# EAGLE board Armaz connector board (EAGLE 7.3.0)
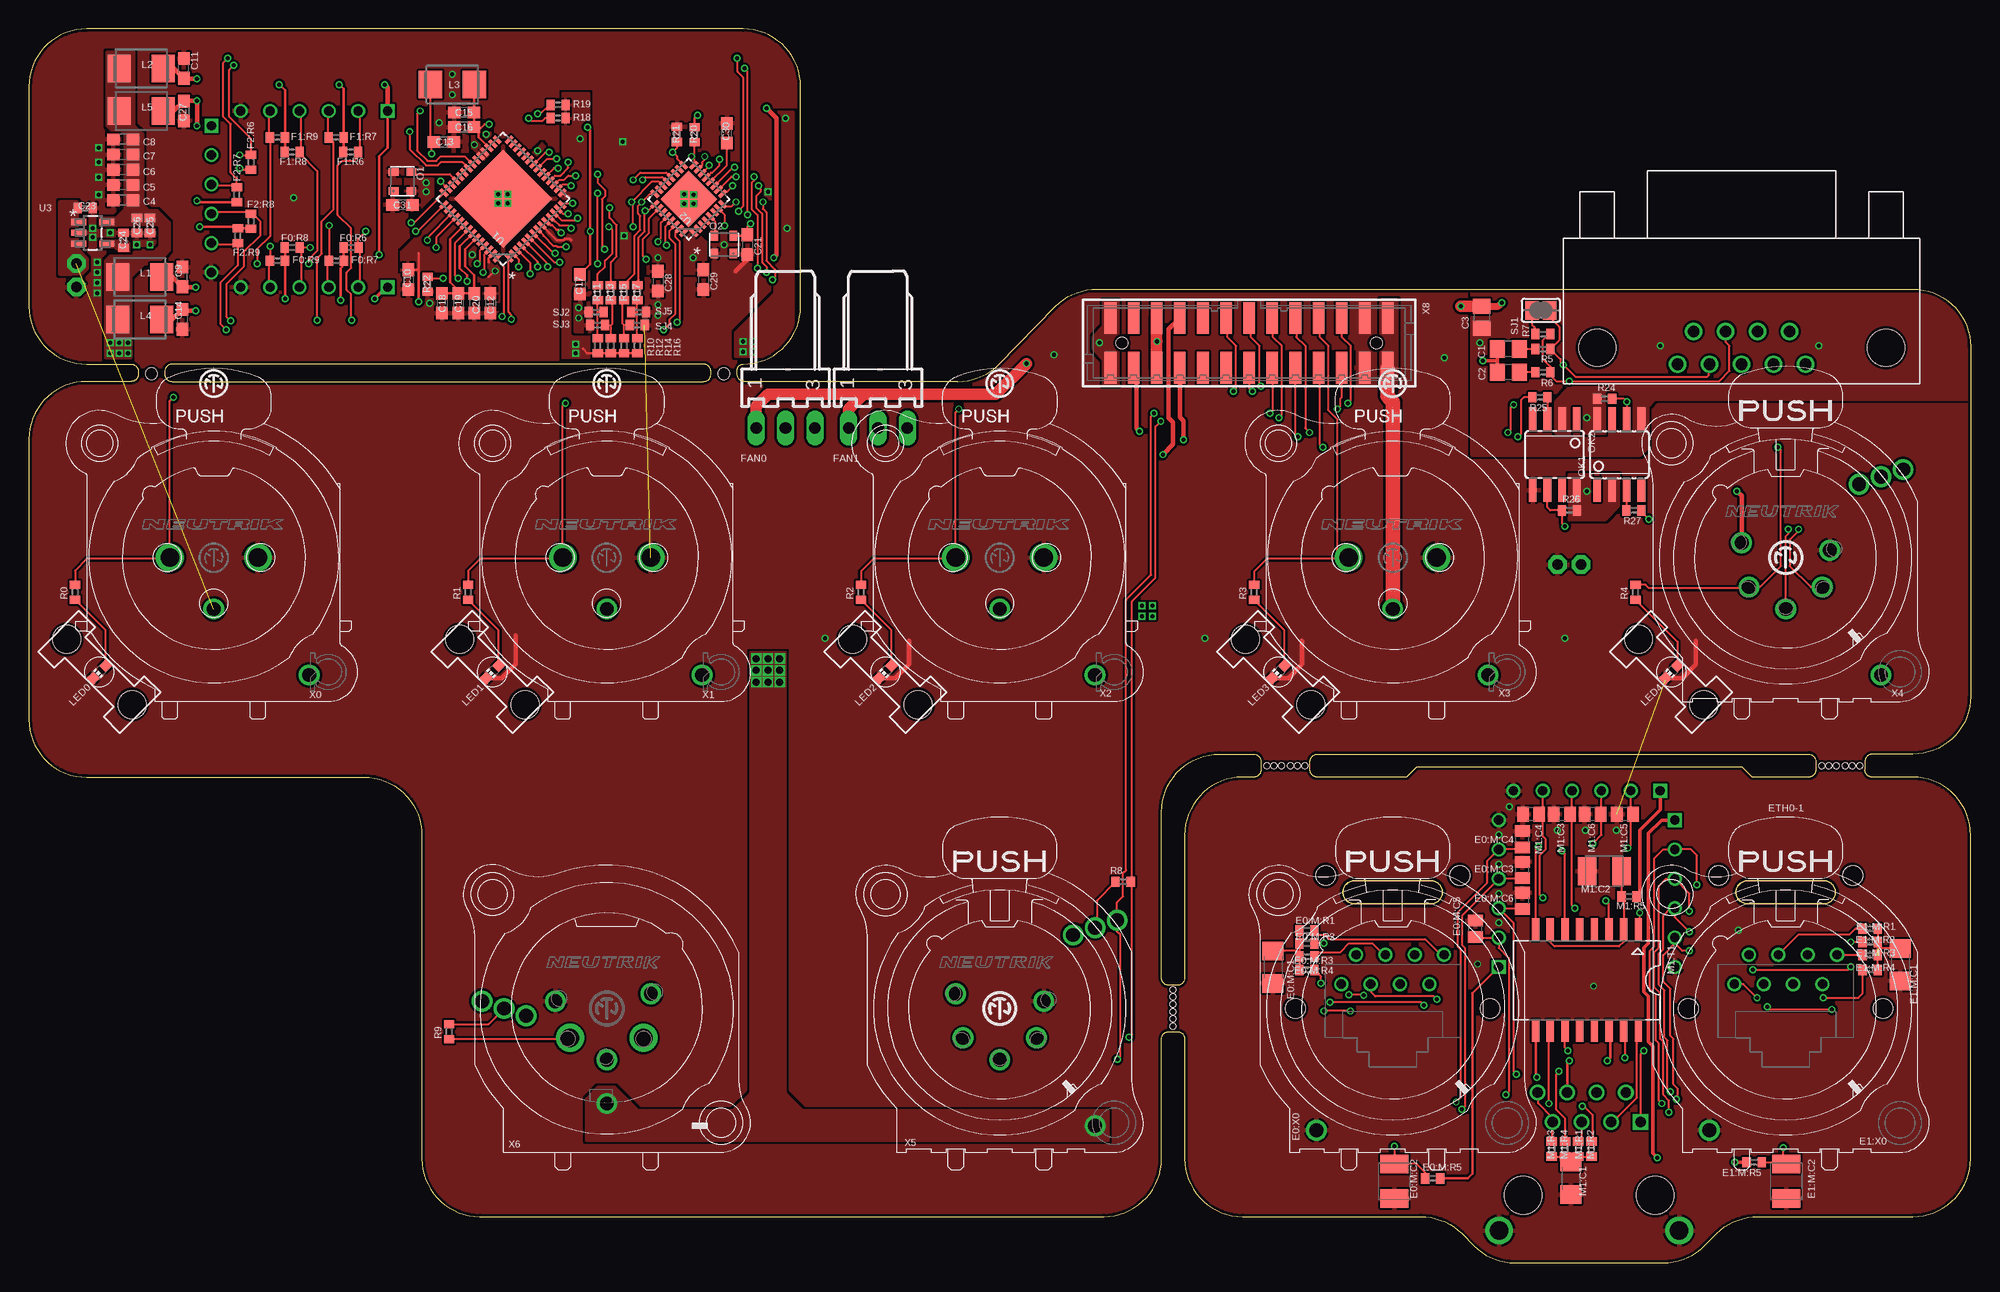
[diagram p6: board, top side]
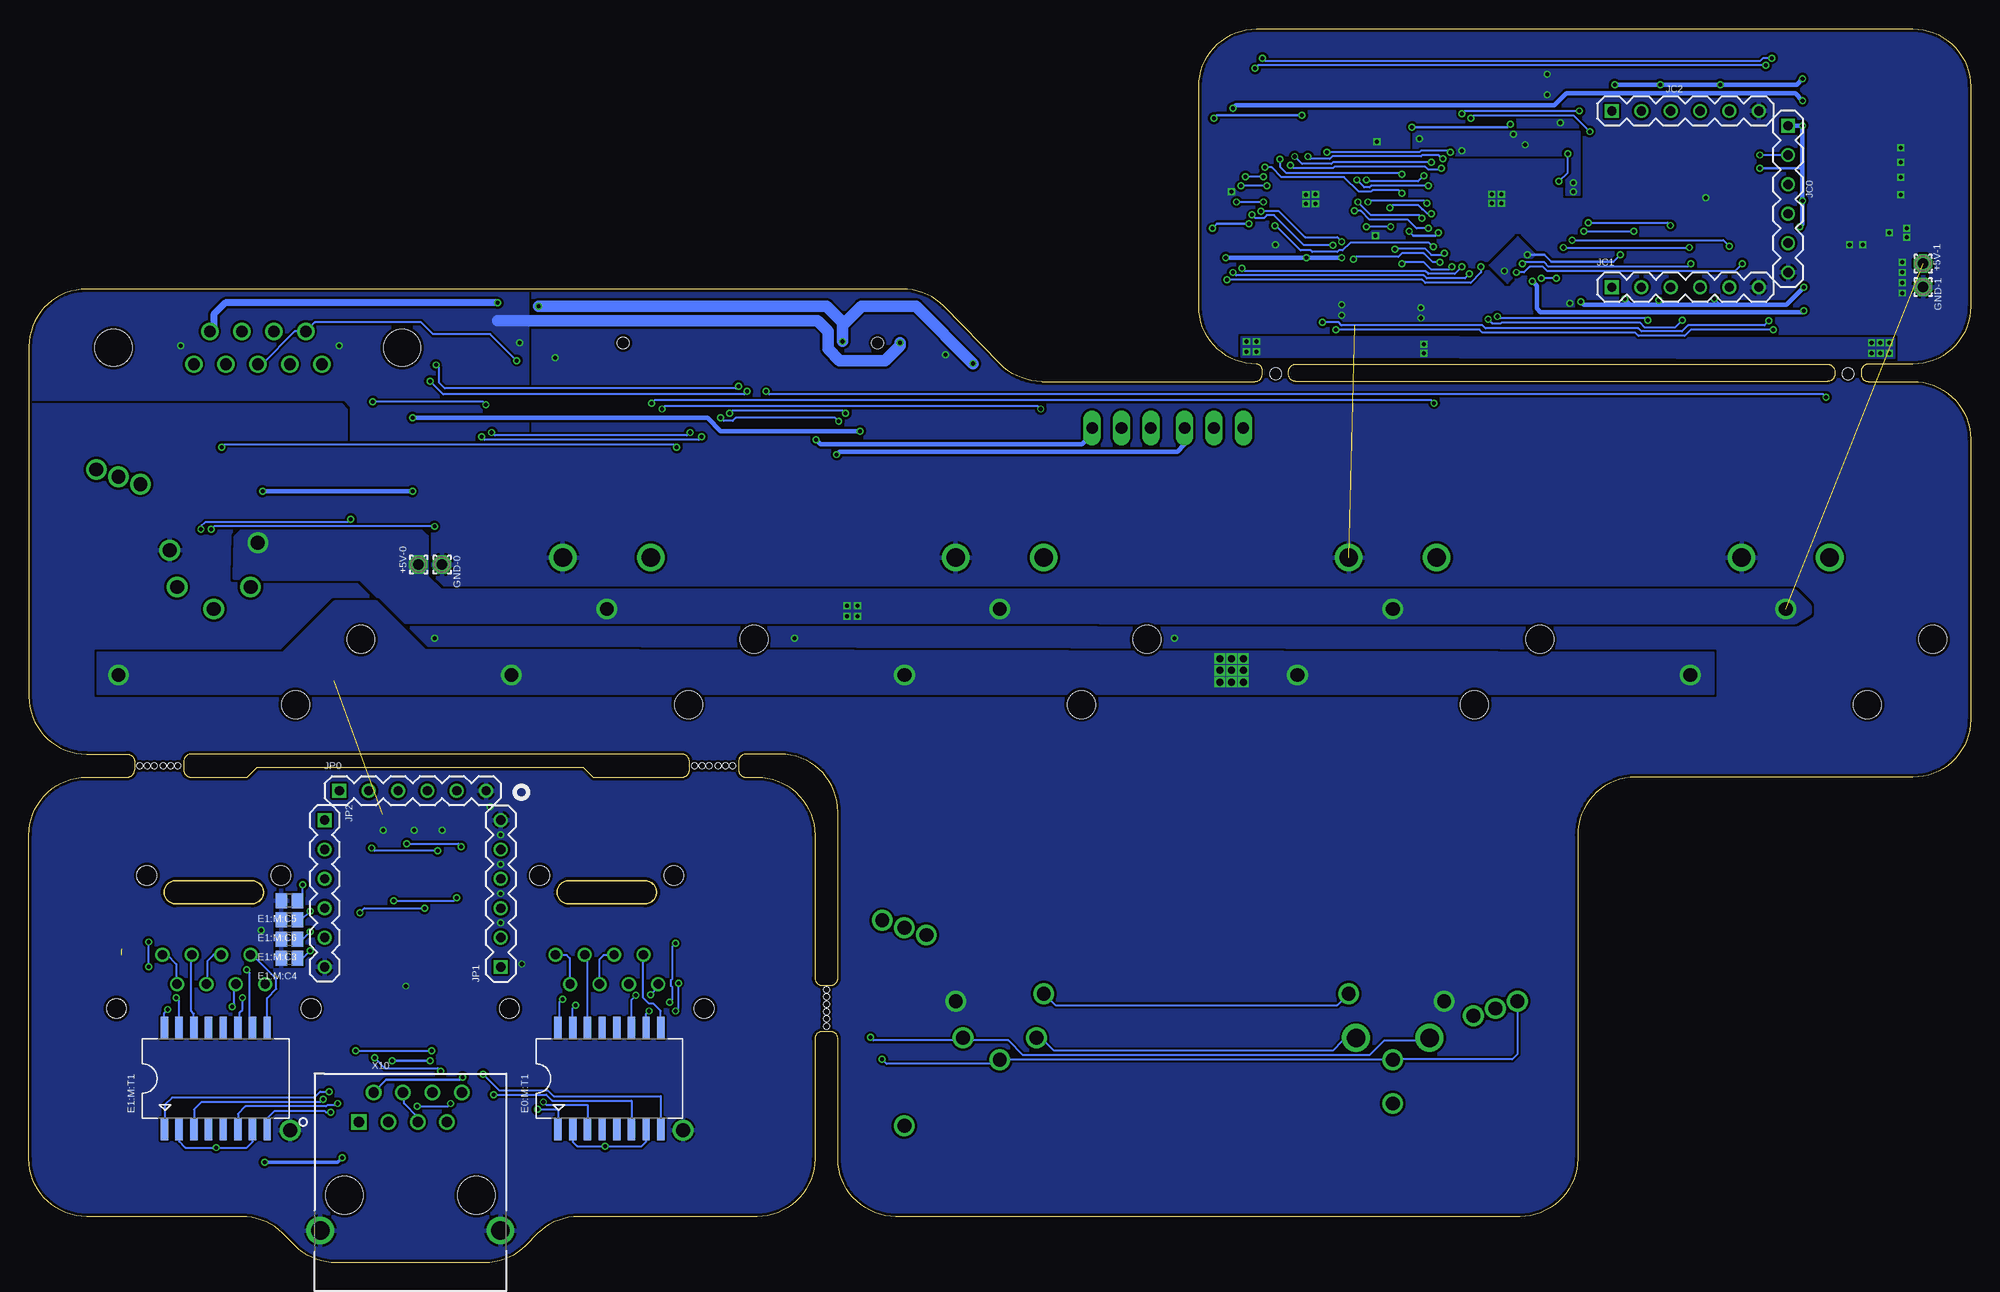
[diagram p7: board, bottom side, seen from below]

Size 168 x 106.73 mm. Coordinates in mm from the lower left corner, seen from the top.
Outline: 0,71.23 0,47 arc90 5,42 29,42 arc-90 34,37 34,9 arc90 39,4 93,4 arc90 98,9 98,19.37 arc-90 98.64,20 99.36,20 arc-90 100,19.37 100,9 arc90 105,4 120.43,4 arc-45 123.96,2.54 125.04,1.46 arc45 128.57,0 141.43,0 arc45 144.96,1.46 146.04,2.54 arc-45 149.57,4 163,4 arc90 168,9 168,37 arc90 163,42 159.5,42 arc-90 158.86,42.63 158.86,43.36 arc-90 159.5,44 163,44 arc90 168,49 168,79.23 arc90 163,84.23 92.41,84.23 arc46 88.84,82.73 83.94,77.73 arc-46 80.36,76.23 61.93,76.23 arc-90 61.29,76.87 61.29,77.24 arc-90 61.78,77.73 arc90 66.78,82.73 66.78,101.73 arc90 61.78,106.73 5,106.73 arc90 0,101.73 0,82.73 arc90 5,77.73 8.84,77.73 arc-90 9.47,77.09 9.47,76.87 arc-90 8.84,76.23 5,76.23 arc90 0,71.23
Outline: 99.36,24 98.64,24 arc-90 98,24.64 98,39 arc-90 103,44 105.97,44 arc-90 106.6,43.36 106.6,42.63 arc-90 105.97,42 105,42 arc90 100,37 100,24.64 arc-90 99.36,24
Outline: 154.61,43.36 154.61,42.63 arc-90 153.97,42 149.11,42 148.25,42.86 120.06,42.86 119.2,42 111.49,42 arc-90 110.85,42.63 110.85,43.36 arc-90 111.49,44 153.97,44 arc-90 154.61,43.36
Outline: 58.37,77.73 12.4,77.73 arc90 11.76,77.09 11.76,76.87 arc90 12.4,76.23 58.37,76.23 arc90 59.01,76.87 59.01,77.09 arc90 58.37,77.73
Copper layers (1*16): Top 0.018mm / dielectric 1.55mm / Bottom 0.018mm
Design rules "eC_2Layer_PClass6_BaseCopperO18_eCDefault *": minimum track width 0.15mm, minimum drill 0.35mm, track to track 0.15mm, track to pad 0.15mm, pad to pad 0.15mm, via to via 0.15mm, smd to smd 0mil, copper to edge 0.25mm, drill to drill 0.35mm, minimum pad ring 0.175mm, minimum via ring 0.125mm, stop-mask expansion 0mil, vias tented up to drill 0.45mm, thermal gap 0.2mm
Net classes: 0 default: width 0.152 mm, drill 0.2 mm, clearance 0.205 mm; 1 supply: width 0.406 mm, drill 0.35 mm, clearance 0.205 mm to class 0, clearance 0.205 mm; 2 supply2: width 0.203 mm, drill 0.25 mm, clearance 0.205 mm to class 0, clearance 0.205 mm to class 1, clearance 0.205 mm
Holes 0.5 mm at 99,23.64 107.1,42.99 99,23 99,22.37 99,21.73 99,21.09 99,20.46 110.41,42.99 109.77,42.99 109.14,42.99 108.37,42.99 107.74,42.99 155.11,42.99 158.41,42.99 157.78,42.99 157.14,42.99 156.38,42.99 155.75,42.99
Holes 1 mm at 10.6,76.9 60.13,76.9

## Footprints (pad centres in the part's own frame; a part is rotated, then mirrored left to right if it is on the bottom)
1,6/0,9 = drill 0.914 pad 1.6 octagon: 1 0,0
C0805 = smd 1.3 x 1.5: 1 -0.95,0; 2 0.95,0
C0603 = smd 1.1 x 1: 1 -0.85,0; 2 0.85,0
C0402 = smd 0.7 x 0.9: 1 -0.65,0; 2 0.65,0
C1206 = smd 1.6 x 1.8: 1 -1.4,0; 2 1.4,0
SMC_B = smd 1.6 x 2.4: + -1.5,0; - 1.5,0
C0504 = smd 1 x 1.3: 1 -0.7,0; 2 0.7,0
R0402 = smd 0.7 x 0.9: 1 -0.65,0; 2 0.65,0
749010012 = smd 0.64 x 1.91: 1 -4.445,-4.385; 2 -3.175,-4.385; 3 -1.905,-4.385; 4 -0.635,-4.385; 5 0.635,-4.385; 6 1.905,-4.385; 7 3.175,-4.385; 8 4.445,-4.385; 9 4.445,4.385; 10 3.175,4.385; 11 1.905,4.385; 12 0.635,4.385; 13 -0.635,4.385; 14 -1.905,4.385; 15 -3.175,4.385; 16 -4.445,4.385
NE8FAV = drill 0.813: 1 -4.445,2.108; 2 -3.175,4.648; 3 -1.905,2.108; 4 -0.635,4.648; 5 0.635,2.108; 6 1.905,4.648; 7 3.175,2.108; 8 4.445,4.648 | drill 1.194: G -6.604,-10.541 | hole 1.7: -8.425,0; 8.425,0; 5.8,11.5; -5.8,11.5
7395-03 = drill 1.016 long: 1 2.54,0; 2 0,0; 3 -2.54,0
1X06 = drill 0.8 square: 1 -6.35,0 | drill 0.8: 2 -3.81,0; 3 -1.27,0; 4 1.27,0; 5 3.81,0; 6 6.35,0
L4532M = smd 2 x 2.4: 1 -1.9,0; 2 1.9,0
CHIP-LED0603 = smd 0.8 x 0.8: A 0,-0.75; C 0,0.75
ADSM = smd 0.65 x 0.85: 1 0.825,-0.775; 2 -0.825,-0.775; 3 -0.825,0.775; 4 0.825,0.775
SOIC08 = smd 0.66 x 2.032: 1 -1.905,-3.073; 2 -0.635,-3.073; 3 0.635,-3.073; 4 1.905,-3.073; 5 1.905,3.073; 6 0.635,3.073; 7 -0.635,3.073; 8 -1.905,3.073
SJ = smd 1.168 x 1.6: 1 -0.762,0; 2 0.762,0
QFN50P800X800X100-57N = smd 0.813 x 0.305: 1 -3.988,3.251; 2 -3.988,2.743; 3 -3.988,2.261; 4 -3.988,1.753; 5 -3.988,1.245; 6 -3.988,0.762; 7 -3.988,0.254; 8 -3.988,-0.254; 9 -3.988,-0.762; 10 -3.988,-1.245; 11 -3.988,-1.753; 12 -3.988,-2.261; 13 -3.988,-2.743; 14 -3.988,-3.251; 29 3.988,-3.251; 30 3.988,-2.743; 31 3.988,-2.261; 32 3.988,-1.753; 33 3.988,-1.245; 34 3.988,-0.762; 35 3.988,-0.254; 36 3.988,0.254; 37 3.988,0.762; 38 3.988,1.245; 39 3.988,1.753; 40 3.988,2.261; 41 3.988,2.743; 42 3.988,3.251 | smd 0.305 x 0.813: 15 -3.251,-3.988; 16 -2.743,-3.988; 17 -2.261,-3.988; 18 -1.753,-3.988; 19 -1.245,-3.988; 20 -0.762,-3.988; 21 -0.254,-3.988; 22 0.254,-3.988; 23 0.762,-3.988; 24 1.245,-3.988; 25 1.753,-3.988; 26 2.261,-3.988; 27 2.743,-3.988; 28 3.251,-3.988; 43 3.251,3.988; 44 2.743,3.988; 45 2.261,3.988; 46 1.753,3.988; 47 1.245,3.988; 48 0.762,3.988; 49 0.254,3.988; 50 -0.254,3.988; 51 -0.762,3.988; 52 -1.245,3.988; 53 -1.753,3.988; 54 -2.261,3.988; 55 -2.743,3.988; 56 -3.251,3.988 | smd 5.994 x 5.994: 57 0,0
QFN50P500X500X100-33N = smd 0.813 x 0.305: 1 -2.388,1.753; 2 -2.388,1.245; 3 -2.388,0.762; 4 -2.388,0.254; 5 -2.388,-0.254; 6 -2.388,-0.762; 7 -2.388,-1.245; 8 -2.388,-1.753; 17 2.388,-1.753; 18 2.388,-1.245; 19 2.388,-0.762; 20 2.388,-0.254; 21 2.388,0.254; 22 2.388,0.762; 23 2.388,1.245; 24 2.388,1.753 | smd 0.305 x 0.813: 9 -1.753,-2.388; 10 -1.245,-2.388; 11 -0.762,-2.388; 12 -0.254,-2.388; 13 0.254,-2.388; 14 0.762,-2.388; 15 1.245,-2.388; 16 1.753,-2.388; 25 1.753,2.388; 26 1.245,2.388; 27 0.762,2.388; 28 0.254,2.388; 29 -0.254,2.388; 30 -0.762,2.388; 31 -1.245,2.388; 32 -1.753,2.388 | smd 3.454 x 3.454: 33 0,0
SOT95P284X122-5N = smd 1.27 x 0.533: 1 -1.219,0.94; 2 -1.219,0; 3 -1.219,-0.94; 4 1.219,-0.94; 5 1.219,0.94
1275.100 = hole 2.4: 4,0; -4,0
NC3FAV2 = drill 1.6: 1 3.81,0; 2 -3.81,0 | drill 1.2: 3 0,-4.45; G 8.25,-10.16
NC5FAV-SW = drill 1.2: 1 3.81,0.635; 2 3.175,-2.54; 3 0,-4.445; 4 -3.175,-2.54; 5 -3.81,1.27; G 8.255,-10.16; N 8.255,6.985; NC 6.35,6.35; NO 10.16,7.62
NC5MAV-SW = drill 1.2: 1 -4.445,0.635; 3 0,-4.445; 5 3.81,1.27; G 0,-8.225; N -8.89,0; NC -6.985,-0.635; NO -10.795,0.635 | drill 1.6: 2 -3.175,-2.54; 4 3.175,-2.54
5504F1-09S-02A = drill 1: 1 -5.54,-1.42; 2 -2.77,-1.42; 3 0,-1.42; 4 2.77,-1.42; 5 5.54,-1.42; 6 -4.155,1.42; 7 -1.385,1.42; 8 1.385,1.42; 9 4.155,1.42 | hole 3.2: -12.495,0; 12.495,0
87832-26 = smd 1 x 2.75: 1 -12,-2.15; 2 -12,2.15; 3 -10,-2.15; 4 -10,2.15; 5 -8,-2.15; 6 -8,2.15; 7 -6,-2.15; 8 -6,2.15; 9 -4,-2.15; 10 -4,2.15; 11 -2,-2.15; 12 -2,2.15; 13 0,-2.15; 14 0,2.15; 15 2,-2.15; 16 2,2.15; 17 4,-2.15; 18 4,2.15; 19 6,-2.15; 20 6,2.15; 21 8,-2.15; 22 8,2.15; 23 10,-2.15; 24 10,2.15; 25 12,-2.15; 26 12,2.15 | hole 1: -11,0; 11,0
MOLEX_85505-5113 = drill 0.9 square: 1 0,0 | drill 0.9: 2 1.27,2.54; 3 2.54,0; 4 3.81,2.54; 5 5.08,0; 6 6.35,2.54; 7 7.62,0; 8 8.89,2.54 | drill 1.6: M1 -3.35,-9.4; M2 12.24,-9.4 | hole 3.25: -1.27,-6.35; 10.16,-6.35

## Placement (x,y rotation side)
+5V-0  WIREPAD1,6/0,9  [1,6/0,9]  134.28,60.39 90 bottom
+5V-1  WIREPAD1,6/0,9  [1,6/0,9]  4.11,86.42 90 bottom
C1  560pF  [C0805]  128,79.03 180 top
C2  560pF  [C0805]  128,77.03 180 top
C3  1uF  [C0805]  125.7,81.79 270 top
C4  4.7uF, 6.3V, 20%  [C0603]  8.16,91.91 180 top
C5  0.1uF, 16V, 10%  [C0603]  8.16,93.23 180 top
C6  0.1uF, 16V, 10%  [C0603]  8.16,94.55 180 top
C7  0.1uF  [C0603]  8.16,95.86 180 top
C8  0.1uF, 16V, 10%  [C0603]  8.16,97.18 180 top
C9  4.7uF, 6.3V, 20%  [C0603]  13.27,85.28 90 top
C10  4.7uF, 6.3V, 20%  [C0603]  32.83,85.05 270 top
C11  4.7uF, 6.3V, 20%  [C0603]  13.4,103.31 90 top
C12  4.7uF, 6.3V, 20%  [C0603]  39.94,82.99 270 top
C13  4.7uF, 6.3V, 20%  [C0603]  35.9,96.96 0 top
C14  4.7uF, 6.3V, 20%  [C0603]  13.27,81.6 270 top
C15  4.7uF, 6.3V, 20%  [C0603]  37.66,99.5 180 top
C16  0.1uF, 16V, 10%  [C0603]  37.66,98.23 180 top
C17  0.1uF, 16V, 10%  [C0603]  47.69,84.65 270 top
C18  4.7uF, 6.3V, 20%  [C0603]  35.75,82.99 270 top
C19  0.1uF, 16V, 10%  [C0603]  37.15,82.99 270 top
C20  0.1uF, 16V, 10%  [C0603]  38.54,82.99 270 top
C21  0.01uF, 6V, 10%  [C0603]  62.17,88.07 270 top
C23  1uF, 16V  [C0402]  4.89,91.23 0 top
C24  10nF, 50V  [C0402]  8.19,88.45 90 top
C25  4.7uF, 6.3V  [C0402]  10.48,89.73 270 top
C26  0.1uF, 16V  [C0402]  9.33,89.73 270 top
C27  4.7uF, 6.3V  [C0603]  13.4,99.63 270 top
C28  0.1uF, 16V  [C0603]  54.42,84.92 270 top
C29  0.1uF, 16V  [C0603]  58.36,85.05 270 top
C30  0.1uF, 16V  [C0603]  60.39,97.71 90 top
C31  0.01uF, 6V, 10%  [C0603]  32.32,91.5 180 top
E0:M:C1  1000pF, 2kV  [C1206]  107.63,25.57 270 top
E0:M:C2  .022uF  [SMC_B]  118.15,7.05 270 top
E0:M:C3  15pF, 50V  [C0504]  129.2,33.97 90 top
E0:M:C4  15pF, 50V  [C0504]  129.2,36.64 90 top
E0:M:C5  15pF, 50V  [C0504]  125.14,28.89 90 top
E0:M:C6  15pF, 50V  [C0504]  129.2,31.3 90 top
E0:M:R1  75  [R0402]  110.58,26.48 0 top
E0:M:R2  75  [R0402]  110.58,25.34 180 top
E0:M:R3  75  [R0402]  110.58,28.74 0 top
E0:M:R4  75  [R0402]  110.58,27.62 180 top
E0:M:R5  10, 1/8W, 1%  [R0402]  121.45,7.3 0 top
E0:M:T1  [749010012]  117.77,15.94 0 bottom
E0:X0  NE8FAV  [NE8FAV]  118,22 0 top
E1:M:C1  1000pF, 2kV  [C1206]  161.91,25.79 270 top
E1:M:C2  .022uF  [SMC_B]  152.06,7.05 270 top
E1:M:C3  15pF, 50V  [C0504]  145.46,28 180 bottom
E1:M:C4  15pF, 50V  [C0504]  145.46,26.35 180 bottom
E1:M:C5  15pF, 50V  [C0504]  145.46,31.3 180 bottom
E1:M:C6  15pF, 50V  [C0504]  145.46,29.65 180 bottom
E1:M:R1  75  [R0402]  159.3,28.89 180 top
E1:M:R2  75  [R0402]  159.3,27.75 0 top
E1:M:R3  75  [R0402]  159.3,26.61 180 top
E1:M:R4  75  [R0402]  159.3,25.34 0 top
E1:M:R5  10, 1/8W, 1%  [R0402]  149.27,8.7 180 top
E1:M:T1  [749010012]  151.83,15.94 0 bottom
E1:X0  NE8FAV  [NE8FAV]  152,22 0 top
F0:R6  49.9, 1/8W, 1%  [R0402]  27.88,87.82 180 top
F0:R7  49.9, 1/8W, 1%  [R0402]  26.61,86.68 0 top
F0:R8  49.9, 1/8W, 1%  [R0402]  22.78,87.82 180 top
F0:R9  49.9, 1/8W, 1%  [R0402]  21.51,86.68 0 top
F1:R6  49.9, 1/8W, 1%  [R0402]  27.86,96.08 180 top
F1:R7  49.9, 1/8W, 1%  [R0402]  26.59,97.34 0 top
F1:R8  49.9, 1/8W, 1%  [R0402]  22.78,96.08 180 top
F1:R9  49.9, 1/8W, 1%  [R0402]  21.51,97.34 0 top
F2:R6  49.9, 1/8W, 1%  [R0402]  19.22,95.19 270 top
F2:R7  49.9, 1/8W, 1%  [R0402]  17.99,92.39 270 top
F2:R8  49.9, 1/8W, 1%  [R0402]  19.22,90.11 270 top
F2:R9  49.9, 1/8W, 1%  [R0402]  18.08,88.84 90 top
FAN0  22-05-7038-03  [7395-03]  65.47,72.2 180 top
FAN1  22-05-7038-03  [7395-03]  73.47,72.2 180 top
GND-0  WIREPAD1,6/0,9  [1,6/0,9]  132.25,60.39 270 bottom
GND-1  WIREPAD1,6/0,9  [1,6/0,9]  4.11,84.39 270 bottom
JC0  [1X06]  15.79,92.01 270 bottom
JC1  [1X06]  24.68,84.39 0 bottom
JC2  [1X06]  24.68,99.63 0 bottom
JP0  [1X06]  134.79,40.83 0 bottom
JP1  [1X06]  127.17,31.94 90 bottom
JP2  [1X06]  142.41,31.94 270 bottom
L1  2.0A/0.05 DCR  [L4532M]  9.59,85.28 0 top
L2  2.0A/0.05 DCR  [L4532M]  9.71,103.31 0 top
L3  2.0A/0.05 DCR  [L4532M]  36.64,101.92 180 top
L4  2.0A/0.05 DCR  [L4532M]  9.59,81.6 0 top
L5  2.0A/0.05 DCR  [L4532M]  9.71,99.63 0 top
LED0  blue  [CHIP-LED0603]  6.1,51.1 135 top
LED1  blue  [CHIP-LED0603]  40.1,51.1 135 top
LED2  blue  [CHIP-LED0603]  74.1,51.1 135 top
LED3  blue  [CHIP-LED0603]  108.1,51.1 135 top
LED4  blue  [CHIP-LED0603]  142.1,51.1 135 top
M1:C1  1000pF, 2kV  [C1206]  133.41,7.3 270 top
M1:C2  .022uF  [SMC_B]  136.31,33.87 180 top
M1:C3  15pF, 50V  [C0504]  132.63,38.8 180 top
M1:C4  15pF, 50V  [C0504]  129.96,38.8 180 top
M1:C5  15pF, 50V  [C0504]  138.09,38.8 180 top
M1:C6  15pF, 50V  [C0504]  135.3,38.8 180 top
M1:R1  75  [R0402]  134.05,9.84 90 top
M1:R2  75  [R0402]  135.19,9.84 270 top
M1:R3  75  [R0402]  131.76,9.84 90 top
M1:R4  75  [R0402]  132.91,9.84 270 top
M1:R5  10, 1/8W, 1%  [R0402]  138.45,31.69 0 top
M1:T1  [749010012]  134.81,24.45 180 top
O1  25MHz  [ADSM]  32.32,93.54 270 top
O2  25MHz  [ADSM]  60.13,88.07 0 top
OK1  HCPL0601  [SOIC08]  137.6,69.91 0 top
OK2  HCPL0601  [SOIC08]  132.02,69.91 180 top
R0  1.5K  [R0402]  4,58 90 top
R1  1.5K  [R0402]  38,58 90 top
R2  1.5K  [R0402]  72,58 90 top
R3  1.5K  [R0402]  106,58 90 top
R4  1.5K  [R0402]  139,58 90 top
R5  100  [R0402]  131,79.03 0 top
R6  100  [R0402]  131,77.03 0 top
R7  120  [R0402]  131,80.33 0 top
R8  120, 1/4W  [R0402]  94.68,32.96 180 top
R9  120, 1/4W  [R0402]  36.36,20 90 top
R10  10K, 1/10W, 1%  [R0402]  49.21,79.33 90 top
R11  10K, 1/10W, 1%  [R0402]  49.21,83.9 90 top
R12  10K, 1/10W, 1%  [R0402]  50.35,79.33 90 top
R13  10K, 1/10W, 1%  [R0402]  50.35,83.9 90 top
R14  10K, 1/10W, 1%  [R0402]  51.5,79.33 90 top
R15  10K, 1/10W, 1%  [R0402]  51.5,83.9 90 top
R16  10K, 1/10W, 1%  [R0402]  52.64,79.33 90 top
R17  10K, 1/10W, 1%  [R0402]  52.64,83.9 90 top
R18  10K, 1/10W, 1%  [R0402]  45.78,99.02 0 top
R19  10K, 1/10W, 1%  [R0402]  45.78,100.16 0 top
R20  10K, 1/10W, 1%  [R0402]  57.59,97.58 90 top
R21  10K, 1/10W, 1%  [R0402]  56.07,97.6 270 top
R22  12K4, 1%  [R0402]  34.5,84.65 90 top
R24  3K3  [R0402]  136.33,74.74 0 top
R25  330  [R0402]  130.75,74.87 180 top
R26  4K7  [R0402]  133.29,65.09 0 top
R27  4K7  [R0402]  138.87,65.09 180 top
SJ1  [SJ]  130.82,82.39 180 top
SJ2  O, DNI  [R0402]  49.09,82.23 180 top
SJ3  O, DNI  [R0402]  49.21,81.11 180 top
SJ4  O, DNI  [R0402]  52.64,81.11 0 top
SJ5  O, DNI  [R0402]  52.77,82.23 0 top
U1  LAN9303-ABZJ  [QFN50P800X800X100-57N]  41.02,92.03 135 top
U2  LAN8710AI-EZK  [QFN50P500X500X100-33N]  57.09,92.01 135 top
U3  LP2992IM5-3.3  [SOT95P284X122-5N]  5.52,89.09 0 top
U$1  [1275.100]  6.1,51.1 315 top
U$2  [1275.100]  40.1,51.1 315 top
U$3  [1275.100]  74.1,51.1 315 top
U$4  [1275.100]  108.1,51.1 315 top
U$5  [1275.100]  142.1,51.1 315 top
X0  NC3FAAV2  [NC3FAV2]  16,61 0 top
X1  NC3FAAV2  [NC3FAV2]  50,61 0 top
X2  NC3FAAV2  [NC3FAV2]  84,61 0 top
X3  NC3FAAV2  [NC3FAV2]  118,61 0 top
X4  NC5FAV-SW  [NC5FAV-SW]  152,61 0 top
X5  NC5FAV-SW  [NC5FAV-SW]  84,22 0 top
X6  NC5MAV-SW  [NC5MAV-SW]  50,22 0 top
X7  5504F1-09S-02A-03  [5504F1-09S-02A]  148.19,79.14 0 top
X8  87832-26  [87832-26]  105.58,79.56 180 top
X10  85505-5113  [MOLEX_85505-5113]  139.44,12.18 0 bottom

## Tracks (layer width: path | path; a pad name or v marks a point on that pad's centre or on a via)
+3V3  (via drill 0.35)
  Top 0.203: R16.1 R14.1 R12.1 R10.1 48.32,78.68 47.94,79.06 | 45.02,89.09 44.39,89.73 U1.9 | U1.9 | O2.4 62.09,88.85 C21.1 62.17,89.62 62.42,89.88 v62.45,89.88 | R20.2 57.59,99 v57.85,99.25 | U1.15 46.43,92.27 46.67,92.27 | U1.9 45.67,88.45 46.27,88.45 46.37,88.56 46.82,88.56 46.93,88.45
  Bottom 0.203: v57.85,99.25 65.21,99.25 v65.47,99 | v62.45,89.88 65.19,89.88 v65.59,89.47
  other vias: 7.05,78.68 7.81,78.68 8.57,78.68 8.57,79.56 7.81,79.56 7.05,79.56 62.67,79.69 61.78,79.69 61.78,78.8 62.67,78.8 34.35,92.65 34.35,93.41 38.54,96.71 39.56,97.6 44.01,96.2 47.69,97.22 47.31,78.68 47.31,79.44
  pour Top (rank 2, no thermals): 6.16,89.73 8.83,89.73 8.95,89.85 11.11,89.85 11.37,89.6 11.37,87.95 10.98,87.57 9.33,87.57 8.83,87.06 7.05,87.06 6.67,86.68 6.67,78.3 8.83,78.3 8.83,85.28 9.97,86.42 11.11,86.42 12.13,87.57 12.13,89.98 11.11,91 10.35,91 9.84,91.5 9.84,97.6 9.08,98.36 9.08,104.71 6.79,104.71 6.79,98.36 7.3,97.85 8.06,97.85 8.32,97.6 8.32,91.12 7.56,90.36 6.16,90.36
  pour Bottom (no thermals): 6.67,78.3 63.05,78.42 63.05,80.07 6.67,79.95
  pour Top (no thermals): 66.1,78.42 61.15,78.42 61.15,80.45 64.58,83.88 64.58,99.5 66.1,99.5
  pour Top: 39.36,95.36 40.58,96.58 39.94,97.22 39.94,97.73 38.34,97.73 38.34,96.41
  pour Top: 42.86,95.31 46.04,92.14 47.56,93.66 44.39,96.84
  pour Top: 32.58,93.79 32.58,91 33.72,91 34.99,92.27 34.99,93.79
  pour Top: 43.88,89.85 44.26,90.23 46.67,87.82 46.29,87.44
  pour Bottom: 33.84,92.39 34.99,92.39 34.99,95.82 48.2,95.82 48.2,97.85 33.84,97.85
  pour Top (rank 2): 46.16,101.16 46.16,78.3 48.45,78.3 48.45,101.16
+5V  (via drill 0.35)  (1 unrouted)
  Top 0.406: X4.5 148.19,66.33 v147.78,66.74
  Top 1.016: 117.54,77.37 X8.2
  Top 1.27: X3.3 118,74.45 117.54,74.99 117.54,77.37
  Bottom 0.406: v147.78,66.74 v134.81,66.74
  other vias: 97.2,56.83 97.2,55.94 96.31,55.94 96.31,56.83
  pour Bottom (rank 5, no thermals): 150.13,59.32 139.31,59.32 135.55,55.56 15.27,55.51 14,56.27 14,56.73 15.27,58 132.4,58 133.66,59.27 133.66,62.73 134.94,64 148.73,64 150,62.73
  pour Top (no thermals): 117.03,83.25 117.03,75.88 118.3,75.88 118.3,83.25
  pour Top (no thermals): 137.48,68.14 133.29,68.14 133.29,64.33 136.33,64.33 137.48,65.47
  pour Top (rank 2, no thermals): 4.13,91.76 4.13,87.69 5.02,86.8 5.02,86.04 4.51,85.53 2.73,85.53 2.73,91.76
+12V  (via drill 0.35)
  Top 0.61: v127.44,83.03 127.16,82.74 C3.1 125.95,82.49 125.03,82.49
  Top 1.016: X8.22 X8.21 97.58,79.71 v97.6,79.69 | v123.89,82.74 C3.1 | v86.3,77.79 83.63,75.12 72.2,75.12 | 72.2,75.12 63.94,75.12 62.93,74.1 FAN0.1 | FAN1.1 70.93,73.85 72.2,75.12
  Bottom 0.61: v127.44,83.03 151,83.03 152,82.03 152,80.91 X7.9
  Bottom 1.016: v97.6,79.69 97.6,81.09 | 97.6,81.09 97.6,81.34 99,82.74 v123.89,82.74 | 97.6,81.09 95.95,82.74 91.25,82.74 v86.3,77.79
AVDD  (via drill 0.35)
  Top 0.203: C27.1 13.4,100.5 13.42,100.52 | v14.79,89.6 17.96,89.6 | F2:R9.2 19.19,89.49 F2:R8.2 | F2:R7.2 14.68,91.74 v14.54,91.88 | F2:R6.2 18.37,94.54 v18.22,94.68
  Top 0.305: 57.53,89.02 U2.1
  Top 0.406: 13.42,100.52 v14.54,100.52 v14.54,98.36 | L5.2 12.55,99.63 C27.1 | 17.96,89.6 F2:R9.2 | v63.82,99.89 64.71,99 64.71,87.19 v64.45,86.93
  Bottom 0.203: v18.22,94.68 14.67,94.68 14.54,94.81
  Bottom 0.406: v63.82,99.89 63.56,100.14 36,100.14 34.99,101.16 15.18,101.16 v14.54,100.52 | JC0.1 v14.54,98.36 14.54,94.81 v14.54,91.88 14.54,89.85 v14.79,89.6 | v64.45,86.93 v57.47,86.93 v54.42,86.93
  pour Top: 55.31,91.63 53.53,89.85 53.53,85.53 58.61,85.53 58.61,88.33
CAN0-H  (via drill 0.35)
  Top 0.152: X7.7 146.81,79.64 147.13,79.31 147.13,77.15 146.24,76.26 v133.29,76.26 132.14,76.26 131.65,76.76 R6.2 131.65,77.52 131,78.17 131,79.82 131.51,80.33 R7.2 | v105.85,75.37 105.6,75.63 105.6,77.4 X8.14
  Bottom 0.152: v105.85,75.37 106.11,75.12 132.14,75.12 v133.29,76.26
CAN0-L  (via drill 0.35)
  Top 0.152: X7.2 145.35,77.65 145.35,76.77 145.22,76.64 133.79,76.64 v132.78,77.66 132.52,77.91 132.52,78.16 R5.2 132.4,79.78 132.4,80.96 131.58,81.78 SJ1.1 | v106.62,75.83 106.49,75.96 106.49,79.31 105.73,80.07 105.73,81.57 X8.13
  Bottom 0.152: v106.62,75.83 106.82,75.63 132.02,75.63 132.52,76.14 132.52,77.41 v132.78,77.66
CAN0_GND  (via drill 0.35)
  Top 0.152: 127.05,78.58 C1.2
  Top 0.305: C1.2 127.05,78.04 | 127.05,78.04 C2.2 | 127.05,78.04 v125.79,78.04
  Bottom 0.152: v125.79,78.04 128.08,80.33 133.03,80.33 134.05,81.34 143.25,81.34 X7.6 144.99,80.56 147.83,77.72 X7.3
DMX0-A  (via drill 0.35)
  Top 0.152: v95.19,19.49 95.44,19.75 95.44,32.84 R8.1 95.44,32.96 95.44,57.21 97.47,59.24 97.47,72.33 v97.93,72.78 | v108.14,73.09 108.39,73.34 108.39,79.31 107.63,80.07 107.63,81.66 X8.11 | X6.2 46.72,19.35 R9.1
  Bottom 0.152: X6.2 47.05,19.24 50.74,19.24 52.01,17.97 81.98,17.97 83.25,19.24 86.95,19.24 X5.2 87.39,19.24 94.93,19.24 v95.19,19.49 | v97.93,72.78 98.23,73.09 106.85,73.09 107.1,72.83 107.89,72.83 v108.14,73.09
DMX0-B  (via drill 0.35)
  Top 0.152: v94.17,17.59 94.42,17.84 94.42,28.38 94.16,28.65 X5.NO 94.16,31.17 94.68,31.69 94.68,33.72 94.93,33.97 94.93,57.34 97.09,59.5 97.09,73.22 v97.34,73.47 | v107.38,73.47 107.63,73.72 107.63,77.36 X8.12
  Bottom 0.152: v94.17,17.59 93.79,17.21 84.35,17.21 X5.3 83.9,17.55 83.86,17.59 50.08,17.59 50.05,17.55 X6.3 49.97,17.59 39.67,17.59 39.2,18.05 X6.NO | v107.38,73.47 107.12,73.72 97.6,73.72 v97.34,73.47
DUPLEX_POL_0
  Top 0.152: R16.2 52.64,82.23 | 52.64,82.23 R17.1 | SJ5.1 52.64,82.23
DV0  (via drill 0.35)
  Top 0.152: v12.51,74.87 12.19,74.55 X0.2 12.09,60.9 5.02,60.9 4,59.88 R0.2 | v104.2,75.37 104.46,75.63 104.46,79.31 103.69,80.07 103.69,81.63 103.58,81.63 X8.15
  Bottom 0.152: v12.51,74.87 12.76,75.12 103.95,75.12 v104.2,75.37
E0:M:N$1  (via drill 0.35)
  Top 0.152: E0:M:R5.1 120.81,7.82 120.06,8.57 118.18,8.57 E0:M:C2.+ v118.15,10.07
  Bottom 0.152: E0:M:T1.2 120.95,10.48 120.57,10.1 118.17,10.1 v118.15,10.08 v118.15,10.07 118.12,10.1 114.98,10.1 114.6,10.48 E0:M:T1.7
E0:M:N$2  (via drill 0.35)
  Top 0.152: v114.34,21.78 v112.06,21.78 | 111.3,25.28 E0:M:R2.1 111.8,24.77 v111.8,24.19
  Bottom 0.152: E0:M:T1.10 114.6,21.53 v114.34,21.78 | v112.06,21.78 111.8,22.03 v111.8,24.19
E0:M:N$3  (via drill 0.35)
  Top 0.152: v120.69,22.29 120.44,22.54 v112.56,22.54 | v112.06,27.62 E0:M:R4.1
  Bottom 0.152: E0:M:T1.15 120.95,22.03 v120.69,22.29 | v112.56,22.54 112.31,22.8 112.31,23.81 112.44,23.94 112.44,24.45 112.31,24.57 112.31,27.37 v112.06,27.62
E0:M:N$8
  Top 0.152: E0:M:R3.1 E0:M:R4.2 E0:M:R1.1 | E0:M:R1.1 E0:M:R2.2 | E0:M:R1.1 109.93,26.82 109.77,26.99 108.69,26.99 E0:M:C1.1
E0:N$1  (via drill 0.35)
  Top 0.152: v115.49,23.13 v115.48,23.13 115.43,23.18 v114.22,23.18
  Bottom 0.152: E0:M:T1.11 115.87,22.75 v115.49,23.13 | v114.22,23.18 113.58,23.81 113.58,24.08 E0:X0.1
E0:N$2
  Bottom 0.152: E0:M:T1.9 113.33,21.78 113.96,22.41 114.34,22.41 114.85,22.92 114.85,26.62 E0:X0.2
E0:N$3  (via drill 0.35)
  Top 0.152: v121.84,22.8 121.58,23.05 116.5,23.05 116.09,23.46 E0:X0.3
  Bottom 0.152: E0:M:T1.16 122.09,20.45 122.09,22.54 v121.84,22.8
E0:N$4
  Bottom 0.152: E0:M:T1.14 119.68,26.42 E0:X0.6
E0:N$5
  Top 0.152: E0:M:R1.2 111.61,26.86 113.45,26.86 114.22,27.62 116.25,27.62 117.22,26.65 E0:X0.4
  Bottom 0.152: E0:X0.4 117.41,26.61 118.28,26.61 118.66,26.23 118.66,24.13 E0:X0.5
E0:N$6
  Top 0.152: E0:M:R3.2 111.59,28.38 112.18,28.38 112.56,28 120.82,28 122.17,26.65 E0:X0.8
  Bottom 0.152: E0:X0.7 121.2,24.13 121.2,26.35 121.45,26.61 122.4,26.61 E0:X0.8
E1:M:N$1  (via drill 0.35)
  Top 0.152: E1:M:R5.1 151.81,8.7 | 151.81,8.7 152.12,8.7 | E1:M:C2.+ 151.96,8.55 151.81,8.7 | 151.81,8.7 v151.81,9.97
  Bottom 0.152: E1:M:T1.2 155,10.5 154.47,9.97 v151.81,9.97 149.14,9.97 148.63,10.48 148.63,11.53 E1:M:T1.7
E1:M:N$2  (via drill 0.35)
  Top 0.152: v149.14,25.34 157.4,25.34 v157.65,25.59 | v157.65,27.75 E1:M:R2.1
  Bottom 0.152: E1:M:T1.10 148.89,20.56 148.89,25.08 v149.14,25.34 | v157.65,25.59 v157.65,27.75
E1:M:N$3  (via drill 0.35)
  Top 0.152: v155.24,22.92 158.28,22.92 158.67,23.3 158.67,25.32 E1:M:R4.1
  Bottom 0.152: E1:M:T1.15 155,22.69 v155.24,22.92
E1:M:N$8  (2 unrouted)
  Top 0.152: E1:M:R1.1 E1:M:R2.2 E1:M:R3.1 E1:M:R4.2 | E1:M:C1.1 159.96,27.18 159.96,27.11 160,27.16
E1:N$1  (via drill 0.35)
  Top 0.152: v149.52,22.92 148.34,24.11 E1:X0.1
  Bottom 0.152: E1:M:T1.11 149.78,20.47 149.78,21.65 149.52,21.91 v149.52,22.92
E1:N$2
  Bottom 0.152: E1:M:T1.9 147.38,22.9 146.6,23.68 146.6,24.57 148.68,26.65 E1:X0.2
E1:N$3  (via drill 0.35)
  Top 0.152: v156,21.91 150.66,21.91 v150.41,22.16
  Bottom 0.152: E1:M:T1.16 156.27,21.63 v156,21.91 | v150.41,22.16 150.22,22.35 150.22,23.98 E1:X0.3
E1:N$4
  Bottom 0.152: E1:M:T1.14 153.73,21.55 153.97,21.78 153.97,26.59 E1:X0.6
E1:N$5
  Top 0.152: E1:M:R1.2 158.03,28.89 157.52,28.38 153.1,28.38 E1:X0.4
  Bottom 0.152: E1:X0.4 152.02,26.65 152.57,26.1 152.57,24.17 E1:X0.5
E1:N$6
  Top 0.152: E1:X0.8 158.61,26.65 E1:M:R3.2
  Bottom 0.152: E1:X0.8 156.04,26.65 155.24,25.84 155.24,24.17 E1:X0.7
EE_SCL/SCL  (via drill 0.35)
  Top 0.152: U1.36 37.51,95.19 35.62,95.19 35.37,94.93 34.35,94.93 32.96,96.33 v32.96,97.85 | R18.1 44.66,99.02 44.39,98.74 43.5,98.74 v43.24,99
  Bottom 0.152: v43.24,99 42.99,99.25 34.35,99.25 v32.96,97.85
EE_SDA/SDA  (via drill 0.35)
  Top 0.152: U1.35 37.72,95.69 35.62,95.69 35.24,95.31 34.48,95.31 33.59,96.2 33.59,99.38 v33.84,99.63 | v44.01,99.38 44.22,99.38 44.86,100.01 45.02,100.01 45.02,100.05 R19.1
  Bottom 0.152: v44.01,99.38 43.75,99.63 v33.84,99.63
ESW0  (via drill 0.35)
  Top 0.152: v46.42,74.36 46.19,74.13 X1.2 46.09,60.9 39.05,60.9 38,59.84 R1.2 | v114.11,74.36 114.36,74.61 114.36,79.31 113.6,80.07 113.6,81.69 X8.5
  Bottom 0.152: v46.42,74.36 46.67,74.61 113.86,74.61 v114.11,74.36
ESW1  (via drill 0.35)
  Top 0.152: v80.45,73.85 80.19,73.59 X2.2 80.09,60.9 73.09,60.9 72,59.81 R2.2 | v113.22,73.85 113.47,74.1 113.47,74.74 113.6,74.87 113.6,77.39 X8.6
  Bottom 0.152: v80.45,73.85 80.71,74.1 112.97,74.1 v113.22,73.85
ESW2
  Top 0.152: R3.2 106,59.79 107.11,60.9 113.09,60.9 X3.2 113.22,61.03 113.22,72.96 112.46,73.72 112.46,79.31 111.7,80.07 111.7,81.6 X8.7
ESW3  (via drill 0.35)
  Top 0.152: v151.34,70.55 151.59,70.29 151.59,60.26 149.79,58.46 X4.4 148.72,58.36 140.16,58.36 139.87,58.65 R4.2 | v111.95,70.55 111.7,70.8 111.7,77.3 X8.8
  Bottom 0.152: v151.34,70.55 151.08,70.8 112.2,70.8 v111.95,70.55
ESW3-RX  (via drill 0.35)
  Top 0.152: R27.1 139.52,64.95 v140.14,64.33 | v153.11,63.44 153.11,63.31 152.35,62.55 152.35,60.26 154.15,58.46 X4.2
  Bottom 0.152: v140.14,64.33 140.4,64.07 152.73,64.07 153.11,63.69 v153.11,63.44
ESW3-TX  (via drill 0.35)
  Top 0.152: OK2.6 131.38,65.34 131.63,65.09 R26.1 132.64,63.96 v132.91,63.69 | v152.22,63.44 152.22,63.05 151.97,62.8 151.97,56.58 X4.3
  Bottom 0.152: v132.91,63.69 151.97,63.69 v152.22,63.44
FAN0_GND  (via drill 0.35)
  Top 0.406: X8.19 98.61,80.75 98.61,73.09 99,72.71 99,70.8 v98.11,69.91
  Bottom 0.406: v98.11,69.91 97.85,70.17 68.64,70.17 68.01,70.8 FAN0.3
FAN1_GND  (via drill 0.35)
  Top 0.406: X8.20 99.58,73.14 99.89,72.83 v99.89,71.18
  Bottom 0.406: v99.89,71.18 99.5,70.8 76.9,70.8 76.01,71.69 FAN1.3
GND  (via drill 0.35)  (2 unrouted)
  Top 0.406: 141.57,50.34 LED4.C 143.04,50.57 144.22,51.75 144.22,53.78 | LED1.C 40.92,50.57 42.1,51.75 42.1,54.29 | LED2.C 74.95,50.57 76.14,51.75 76.14,53.78 | LED3.C 108.97,50.57 110.16,51.75 110.16,53.78 | C21.2 62.17,86.8 61.15,85.79
  other vias: 132.88,54.04 101.77,54.04 68.88,54.04 135.38,23.94 122.47,78.3 88.69,78.55 125.35,25.84 127.17,31.94 127.17,29.4 147.91,28.77 134.66,37.4 137.33,37.4 132.25,37.4 128.1,39.43 127.17,34.48 127.17,37.02 5.52,89.47 5.52,88.71 7.05,89.09 9.33,88.07 10.48,88.07 6.03,92.39 6.03,93.92 6.03,95.19 6.03,96.46 36.64,101.03 36.64,102.81 34.66,82.99 22.92,92.14 5.91,86.55 5.91,85.66 5.91,84.77 5.91,83.88 41.44,92.44 40.6,92.44 40.6,91.63 41.44,91.63 56.68,92.42 57.49,92.39 57.49,91.6 56.68,91.6 47.56,81.72 47.56,82.61 35.5,98.62 54.42,82.87 54.42,81.98 51.5,88.84 51.37,96.96 60.13,88.07 63.94,92.65
  pour Bottom (rank 6): 0,-1.27 168,-1.27 168,106.73 0,106.73
  pour Top (rank 6): 0,-1.27 168,-1.27 168,106.73 0,106.73
  pour Bottom (rank 5, no thermals): 44.13,23.81 44.13,21.27 47.18,21.27 47.18,23.81
  pour Bottom (rank 5, no thermals): 86.3,21.27 89.34,21.27 89.34,24.32 86.3,24.32
  pour Top (no thermals): 116.27,83.38 116.27,75.88 115,75.88 115,83.38
  pour Top: 49.09,84.01 49.09,80.58 47.31,80.58 47.31,84.01
  pour Top (rank 2): 39.18,95.19 38.92,94.93 37.53,96.33 37.78,96.58
GND1  (via drill 0.35)
  Bottom 1.016: 127.44,81.47 99.76,81.47 98.87,80.58 98.87,79.06 97.85,78.04 93.92,78.04 92.65,79.31 v92.65,79.56
  other vias: 141.16,79.31 154.88,79.31 125.54,79.56
  pour Top (rank 5, no thermals): 124.9,84.39 168.59,84.39 168.59,74.74 140.65,74.74 140.02,74.1 140.02,70.55 139.38,69.91 124.9,69.91
  pour Bottom (rank 5, no thermals): 124.9,84.39 124.9,69.91 139.38,69.91 140.02,70.55 140.02,74.1 140.65,74.74 168.59,74.74 168.59,84.39
  pour Top (no thermals): 93.03,83.12 93.03,80.96 92.14,80.07 92.14,79.06 93.03,78.17 93.03,76.01 94.17,76.01 94.17,83.12
GNDIO  (via drill 0.6)
  other vias: 64.96,50.23 63.94,50.23 62.93,50.23 63.94,52.26 62.93,52.26 64.96,52.26 63.94,51.24 64.96,51.24 62.93,51.24
  pour Bottom (rank 2, no thermals): 22.29,52.77 22.29,49.21 162,49.21 162,52.77 145.98,52.77 141.54,57.21 137.97,57.21 133.77,53.02
  pour Top (no thermals): 48.2,14.16 48.2,10.6 93.41,10.6 93.41,13.14 66.99,13.14 65.47,14.67 65.47,52.77 62.42,52.77 62.42,14.67 60.9,13.14 52.77,13.14 50.74,15.18 49.21,15.18
M1:N$1
  Top 0.152: M1:T1.7 131.62,28.81 131.62,27.75 132,27.37 137.58,27.37 137.99,27.77 M1:T1.2 137.99,31.5 M1:R5.1 137.8,33.85 M1:C2.+
M1:N$2  (via drill 0.35)
  Top 0.152: M1:R2.1 135.3,10.6 135.3,10.96 135.32,10.99 135.32,12.76 134.56,13.53 v134.41,13.53 | v131.51,13.78 131.51,19.93 M1:T1.10
  Bottom 0.152: v134.41,13.53 131.76,13.53 v131.51,13.78
M1:N$3  (via drill 0.35)
  Top 0.152: M1:T1.15 138.09,19.96 v138.09,17.72 | v132.38,16.57 132.12,16.32 132.12,13.27 132.91,12.49 M1:R4.1
  Bottom 0.152: v138.09,17.72 137.2,16.83 132.63,16.83 v132.38,16.57
M1:N$8
  Top 0.152: M1:C1.1 133.41,8.68 M1:R4.2 | M1:R3.1 M1:R4.2 | M1:R4.2 M1:R1.1 M1:R2.2
MDC  (via drill 0.35)
  Top 0.152: U1.22 44.71,96.08 v45.02,96.08 | U2.17 56.07,95.51 56.07,95.69 v55.69,96.08 56.07,96.46 R21.2
  Bottom 0.152: v45.02,96.08 45.15,96.2 47.56,96.2 47.69,96.08 v55.69,96.08
MDIO  (via drill 0.35)
  Top 0.152: U1.21 44.85,95.49 v45.66,95.49 | U2.16 57.53,95.5 v57.34,95.69 57.59,95.95 R20.1
  Bottom 0.152: v45.66,95.49 45.71,95.49 46.04,95.82 47.43,95.82 47.56,95.69 55.23,95.69 55.44,95.49 57.14,95.49 v57.34,95.69
N$1
  Top 0.152: LED1.A 40.63,54.72 R1.1
N$2
  Top 0.152: LED2.A 74.63,54.72 R2.1
N$3
  Top 0.152: LED3.A 108.63,54.72 R3.1
N$4
  Top 0.152: R4.1 142.63,53.72 LED4.A
N$5
  Top 0.152: R5.1 C1.1
N$6
  Top 0.152: R6.1 C2.1
N$7
  Top 0.152: SJ1.2 130.06,81.14 130.24,80.96 130.24,80.44 R7.1
N$8
  Top 0.152: R8.2 92.39,31.32 92.39,29.91 92.25,29.77 X5.N
N$9  (via drill 0.35)
  Top 0.152: X10.1 139.49,12.23 139.49,18.1 v139.74,18.35 | v133.14,18.35 132.91,18.59 M1:T1.11
  Bottom 0.152: v139.74,18.35 v133.14,18.35
N$10  (via drill 0.35)
  Top 0.203: v130.47,16.07 130.37,16.17 M1:T1.9
  Bottom 0.203: X10.2 137.08,15.81 130.73,15.81 v130.47,16.07
N$11
  Top 0.152: M1:T1.16 139.11,19.91 139.11,19.01 139.13,18.99 139.13,14.29 137.29,12.45 137.1,12.26 137.02,12.18 X10.3
N$12
  Top 0.152: M1:R1.2 134.36,10.8 X10.5
  Bottom 0.152: X10.5 134.36,12.59 135.55,13.78 135.55,14.64 X10.4
N$13
  Top 0.152: M1:R3.2 131.82,10.55 X10.7 131.82,12.56 130.6,13.78 130.6,14.67 X10.8
  Top 0.406: M1:R3.2 131.82,10.49
N$14  (via drill 0.35)
  Top 0.203: X10.6 133.09,17.29 v133.27,17.46 | v136.57,17.46 136.82,17.72 136.82,19.96 M1:T1.14
  Bottom 0.203: v133.27,17.46 v136.57,17.46
N$15
  Top 0.152: R9.2 39.76,20.65 X6.N
N$16
  Top 0.152: LED0.A 6.63,54.72 R0.1
N$17
  Top 0.152: R25.1 131.38,74.85 OK2.3
N$19
  Top 0.152: C24.1 7.83,87.81 | 6.82,88.07 U3.4
  pour Top (no thermals): 6.16,88.45 8.45,88.45 8.7,88.2 8.7,87.44 7.81,87.44 7.43,87.82 6.16,87.82
N$20
  Top 0.152: OK1.3 138.22,66.83 R27.2
N$21  (via drill 0.35)
  Top 0.152: U1.49 36.87,88.23 36.87,85.41 v37.12,85.15 | v35.85,85.15 34.64,85.15 R22.2
  Bottom 0.152: v35.85,85.15 v37.12,85.15
N$22  (via drill 0.35)
  Top 0.152: v127.81,14.54 128.06,14.79 128.06,26.35 127.17,27.24 JP1.2 125.2,28.13 E0:M:C5.1
  Bottom 0.152: v127.81,14.54 123.23,14.54 122.72,14.03 115.87,14.03 E0:M:T1.6
N$23  (via drill 0.35)
  Top 0.152: E0:M:C6.1 129.14,30.67 JP1.3 128.44,29.4 128.44,16.57 v128.69,16.32
  Bottom 0.152: v128.69,16.32 127.3,14.92 123.11,14.92 122.6,14.41 113.33,14.41 E0:M:T1.8
N$24  (via drill 0.35)
  Top 0.152: E0:M:C3.1 129.14,33.21 JP1.4 124,30.04 124,27.5 124.25,27.24 124.25,13.53 v124,13.27
  Bottom 0.152: v124,13.27 122.22,13.27 E0:M:T1.1
N$25  (via drill 0.35)
  Top 0.152: E0:M:C4.1 129.01,35.75 JP1.5 126.15,34.73 126.15,32.83 123.61,30.29 123.61,27.37 123.87,27.11 123.87,14.29 v123.49,13.91
  Bottom 0.152: v123.49,13.91 123.23,13.65 119.68,13.65 E0:M:T1.3
N$26  (via drill 0.35)
  Top 0.152: M1:T1.1 139.36,28.94 v139.36,30.29 | v133.77,30.67 133.52,30.92 133.52,38.92 | 133.52,38.92 JP0.4 | M1:C3.1 133.46,38.92 133.52,38.92
  Bottom 0.152: v139.36,30.29 138.98,30.67 v133.77,30.67
N$27
  Bottom 0.152: X5.4 80.61,19.24 80.2,19.24 79.31,18.35 55.18,18.35 54.29,19.24 53.4,19.24 X6.4
N$28
  Bottom 0.152: X5.5 80.17,23.27 79.18,22.29 54.79,22.29 X6.5
N$29  (via drill 0.35)
  Top 0.305: E1:M:R5.2 v147.62,8.7 | v140.89,9.08 140.5,9.46 140.5,18.73 140.12,19.11 140.12,23.05 139.74,23.43 139.74,27.24 140.12,27.62 140.12,37.15 141.27,38.29 JP2.1
  Bottom 0.305: v147.62,8.7 141.27,8.7 v140.89,9.08
N$30
  Top 0.305: M1:R5.2 139.36,31.95 139.36,37.4 141.14,39.18 JP0.1
N$31  (via drill 0.35)
  Top 0.152: 136.06,38.74 136.06,37.02 v135.3,36.26 | 136.06,38.74 JP0.3 | v130.6,36 130.34,35.75 130.34,28.85 M1:T1.8 | M1:C6.1 136.06,38.74
  Bottom 0.152: v135.3,36.26 130.85,36.26 v130.6,36
N$32  (via drill 0.35)
  Top 0.152: M1:T1.6 132.91,35.35 v132.63,35.62 | v138.35,35.88 138.6,36.13 138.6,38.61 | 138.6,38.61 JP0.2 | M1:C5.1 138.6,38.61
  Bottom 0.152: v132.63,35.62 138.09,35.62 v138.35,35.88
N$33  (via drill 0.35)
  Top 0.152: M1:T1.3 136.72,31.03 v136.44,31.3 | v130.98,31.56 130.73,31.81 130.73,35.24 131.23,35.75 131.23,36.64 130.98,36.89 130.98,38.67 | 130.98,38.67 JP0.5 | M1:C4.1 130.79,38.67 130.98,38.67
  Bottom 0.152: v136.44,31.3 131.23,31.3 v130.98,31.56
N$38
  Top 0.203: JP1.1 124.88,23.3 124.88,7.68 124.5,7.3 E0:M:R5.2
N$300  (via drill 0.35)
  Top 0.152: v141.27,13.78 141.01,14.03 141.01,18.99 140.76,19.24 140.76,23.18 140.25,23.68 140.25,26.99 140.63,27.37 140.63,34.99 141.39,35.75 JP2.2 143.81,35.75 144.31,35.24 v144.31,32.7
  Bottom 0.152: v141.27,13.78 141.39,13.65 142.16,13.65 142.28,13.53 149.27,13.53 149.9,12.89 149.9,11.57 E1:M:T1.6 | E1:M:C5.1 144.31,31.75 v144.31,32.7
N$301  (via drill 0.35)
  Top 0.152: v141.9,13.02 141.9,14.03 141.39,14.54 141.39,19.11 141.14,19.37 141.14,23.3 140.63,23.81 140.63,26.86 141.01,27.24 141.01,32.57 141.65,33.21 JP2.3 143.68,31.94 v143.68,30.42
  Bottom 0.152: v141.9,13.02 142.28,13.02 142.41,13.14 146.73,13.14 147.36,12.51 147.36,11.57 E1:M:T1.8 | E1:M:C6.1 144.44,29.65 v143.68,30.42
N$302  (via drill 0.35)
  Top 0.152: v142.03,14.79 141.78,15.05 141.78,19.24 141.52,19.49 141.52,23.56 141.01,24.07 141.01,26.73 141.39,27.11 141.39,30.04 142.03,30.67 JP2.4 142.41,29.91 v143.68,28.64
  Bottom 0.152: E1:M:T1.1 156.25,11.57 156.25,13.65 155.62,14.29 143.3,14.29 142.79,14.79 v142.03,14.79 | E1:M:C3.1 144.31,28 v143.68,28.64
N$303  (via drill 0.35)
  Top 0.152: v142.54,14.16 142.54,14.41 142.66,14.54 142.66,15.05 142.28,15.43 142.28,19.37 142.03,19.62 142.03,23.68 141.39,24.32 141.39,26.61 142.41,27.62 | 142.41,27.62 JP2.5 | v143.68,26.99 143.04,26.99 142.41,27.62
  Bottom 0.152: v142.54,14.16 142.79,13.91 153.08,13.91 153.71,13.27 153.71,11.57 E1:M:T1.3 | E1:M:C4.1 144.31,26.35 v143.68,26.99
P0_COL  (via drill 0.35)
  Top 0.152: U1.18 45.52,94.04 45.99,94.04 46.67,94.73 v46.67,95.19 | v58.48,95.69 58.48,95.44 58.23,95.19 58.23,94.91 U2.15
  Bottom 0.152: v46.67,95.19 55.18,95.19 55.31,95.06 57.85,95.06 v58.48,95.69
P0_CRS  (via drill 0.35)
  Top 0.152: U1.19 45.44,94.68 v45.78,94.68 | v58.86,94.93 58.86,94.87 U2.14
  Bottom 0.152: v45.78,94.68 45.91,94.55 46.93,94.55 47.18,94.81 55.05,94.81 55.18,94.68 58.61,94.68 v58.86,94.93
P0_INCLK  (via drill 0.35)
  Top 0.152: U1.8 44.51,88.9 44.51,88.84 45.4,87.95 45.66,87.95 45.73,87.87 v46.49,87.87 | U2.7 60.19,90.67 v60.19,89.7
  Bottom 0.152: v46.49,87.87 46.88,88.25 53.66,88.25 54.34,87.57 54.67,87.57 54.8,87.44 56.96,87.44 57.09,87.57 57.98,87.57 60.11,89.7 v60.19,89.7
P0_IND0  (via drill 0.35)
  Top 0.152: U1.5 44.89,86.4 v44.89,86.17 | v49.21,86.42 v49.21,92.52 | U2.11 60.91,94.75 v61.05,94.75
  Bottom 0.152: v44.89,86.17 45.15,85.92 46.67,85.92 47.31,86.55 49.09,86.55 v49.21,86.42 | v49.21,92.52 49.47,92.77 51.75,92.77 51.88,92.65 52.95,92.65 54.22,93.92 59.63,93.92 60.46,94.75 v61.05,94.75
P0_IND1  (via drill 0.35)
  Top 0.152: U1.4 44.01,86.57 v44.01,86.17 | v63.05,86.04 63.05,90.61 62.55,91.12 62.55,93.43 62.75,93.64 v62.75,93.94 | U2.10 60.78,93.94 v61.2,93.94
  Bottom 0.152: v44.01,86.17 44.64,85.53 46.93,85.53 47.18,85.79 62.8,85.79 v63.05,86.04 | v61.2,93.94 v62.75,93.94
P0_IND2  (via drill 0.35)
  Top 0.152: U1.3 43.37,86.48 v43.37,85.53 | U2.9 60.2,92.65 60.39,92.65 v60.9,93.15 | v63.13,93.15 63.13,93.08 63.31,92.9 63.31,92.65 62.93,92.27 62.93,91.25 63.44,90.74 63.44,86.55 63.82,86.17 v63.82,85.66
  Bottom 0.152: v43.37,85.53 43.75,85.15 47.05,85.15 47.31,85.41 63.56,85.41 v63.82,85.66 | v60.9,93.15 v63.13,93.15
P0_IND3  (via drill 0.35)
  Top 0.152: U1.2 42.35,86.82 v42.35,86.17 | U2.8 60.2,91.38 60.79,91.38 v61.17,91.76 | v63.51,91.76 63.51,91.17 63.82,90.87 63.82,86.68 64.58,85.92 64.58,85.28 v64.33,85.03
  Bottom 0.152: v42.35,86.17 42.35,85.66 43.24,84.77 47.18,84.77 47.43,85.03 v64.33,85.03 | v61.17,91.76 v63.51,91.76
P0_INDV  (via drill 0.35)
  Top 0.152: U1.6 45.42,86.55 v45.91,86.55 | v53.4,86.8 53.15,87.06 53.15,88.58 53.66,89.09 53.66,90.34 U2.26
  Bottom 0.152: v45.91,86.55 46.55,86.55 47.31,87.31 49.21,87.31 49.52,87.01 53.2,87.01 v53.4,86.8
P0_INER  (via drill 0.35)
  Top 0.152: U2.13 59.01,94.3 59.12,94.3 59.75,94.93 v59.75,95.44 | v49.21,94.17 49.21,93.41 49.85,92.77 49.85,92.27 49.59,92.01 49.59,87.87 v49.8,87.67 | U1.7 45.38,87.31 v45.53,87.31
  Bottom 0.152: v59.75,95.44 59.75,94.81 59.24,94.3 49.34,94.3 v49.21,94.17 | v49.8,87.67 49.72,87.74 47.23,87.74 46.67,87.19 45.66,87.19 v45.53,87.31
P0_MODE0
  Top 0.152: R10.2 49.21,82.23 | 49.21,82.23 R11.1 | SJ2.1 49.21,82.23
P0_MODE2
  Top 0.152: R14.2 51.5,81.09 | 51.5,81.09 51.5,81.11 SJ4.1 | 51.5,81.09 51.37,81.22 51.37,83.12 R15.1
P0_OUTCLK  (via drill 0.35)
  Top 0.152: U1.17 45.86,93.66 46.29,93.66 46.67,94.04 v47.31,94.04 | v52.26,93.66 52.9,94.3 55.16,94.3 U2.20
  Bottom 0.152: v47.31,94.04 47.81,93.54 52.13,93.54 v52.26,93.66
P0_OUTD0/P0_MODE0  (via drill 0.35)
  Top 0.152: U1.14 46.27,91.63 v47.05,91.63 | U2.22 54.48,93.54 53.91,93.54 v52.13,91.76 52.26,91.63 v52.26,89.6 | R11.2 49.21,85.53 49.85,86.17 49.85,86.68 50.48,87.31 50.48,89.29 v50.18,89.6
  Bottom 0.152: v47.05,91.63 47.31,91.88 52.01,91.88 v52.13,91.76 | v50.18,89.6 v52.26,89.6
P0_OUTD1/P0_MODE1  (via drill 0.35)
  Top 0.152: U1.13 46.19,90.74 v46.67,90.74 | R13.2 50.35,86.55 50.86,87.06 50.86,89.75 50.23,90.39 v50.23,91.25
  Bottom 0.152: v46.67,90.74 47,90.74 47.38,91.12 47.43,91.12 47.81,91.5 49.97,91.5 v50.23,91.25
P0_OUTD2/P0_MODE2  (via drill 0.35)
  Top 0.152: U1.12 46.09,90.16 47.26,90.16 v47.46,90.36 | U2.24 53.73,92.46 v53.02,91.76 52.72,91.45 52.72,90.74 52.9,90.56 52.9,89.34 52.39,88.84 52.39,85.53 51.5,84.65 R15.2
  Bottom 0.152: v47.46,90.36 47.71,90.61 51.88,90.61 v53.02,91.76
P0_OUTD3/DUPLEX_POL_0  (via drill 0.35)
  Top 0.152: U1.11 45.42,90.11 45.53,90.11 45.91,89.73 46.67,89.73 v46.93,89.47 | U2.25 53.59,91 v53.3,91 53.28,90.97 53.28,89.22 52.77,88.71 52.77,85.03 52.64,84.9 R17.2
  Bottom 0.152: v46.93,89.47 47.94,89.47 48.7,90.23 52.01,90.23 52.77,91 v53.3,91
P0_OUTDV  (via drill 0.35)
  Top 0.152: U1.16 46.16,93.28 46.8,93.28 v46.93,93.15 | v53.1,93.66 53.35,93.92 54.82,93.92 U2.21
  Bottom 0.152: v46.93,93.15 51.88,93.15 52.01,93.03 52.46,93.03 v53.1,93.66
PO_MODE1
  Top 0.152: R12.2 50.35,81.09 | 50.35,81.09 50.35,81.11 SJ3.1 | 50.35,81.09 50.48,81.22 50.48,82.99 50.35,83.12 R13.1
RXN0  (via drill 0.35)
  Top 0.152: JC0.5 15.92,88.07 17.96,88.07 F2:R9.1 18.08,86.28 16.57,84.77 16.57,81.22 v17.08,80.71 | v54.93,80.71 55.44,81.22 55.44,81.6 55.94,82.11 55.94,88.1 55.44,88.61 55.44,89.28 U2.30
  Bottom 0.152: v17.08,80.71 24.19,80.71 24.73,80.17 28.74,80.17 29.02,80.45 42.23,80.45 42.48,80.71 v54.93,80.71
RXN1  (via drill 0.35)
  Top 0.152: U1.45 34.48,88.68 v34.48,88.45 | JC1.5 20.76,84.5 20.76,86.59 F0:R9.1 20.86,87.91 v20.89,87.95
  Bottom 0.152: v34.48,88.45 21.4,88.45 v20.89,87.95
RXN2  (via drill 0.35)
  Top 0.152: JC2.5 20.76,99.52 20.76,97.44 F1:R9.1 20.86,88.8 19.75,87.69 v19.75,86.42 | U1.54 39.38,87.19 39.38,85.74 v39.31,85.66
  Bottom 0.152: v19.75,86.42 20.38,85.79 36.64,85.79 36.99,86.14 38.16,86.14 38.65,85.66 v39.31,85.66
RXP0  (via drill 0.35)
  Top 0.152: JC0.4 15.92,90.87 19.11,90.87 F2:R8.1 19.35,90.76 20,90.11 20,88.84 18.61,87.44 18.61,86.17 17.08,84.65 17.08,81.85 v17.46,81.47 | v56.07,81.34 56.32,81.6 56.32,88.33 55.94,88.71 55.94,89.11 U2.31
  Bottom 0.152: v17.46,81.47 17.84,81.09 24.45,81.09 24.98,80.56 28.49,80.56 28.77,80.84 41.97,80.84 42.23,81.09 54.42,81.09 54.67,81.34 v56.07,81.34
RXP1  (via drill 0.35)
  Top 0.152: U1.46 35.24,88.72 v35.24,87.82 | JC1.4 23.56,84.54 23.56,87.69 F0:R8.1 v24.32,87.82
  Bottom 0.152: v35.24,87.82 v24.32,87.82
RXP2  (via drill 0.35)
  Top 0.152: U1.53 39,87.53 39,86.6 v38.8,86.4 | v24.19,86.42 24.19,86.78 24.95,87.54 24.95,94.42 23.43,95.95 F1:R8.1 23.56,96.21 23.56,99.48 JC2.4
  Bottom 0.152: v24.19,86.42 24.45,86.17 36.51,86.17 36.87,86.53 38.67,86.53 v38.8,86.4
TXN0  (via drill 0.35)
  Top 0.152: JC0.3 15.92,93.15 17.96,93.15 17.96,93.07 F2:R7.1 17.99,93.77 17.46,94.3 17.46,98.49 16.83,99.12 16.83,103.82 v17.21,104.2 | v61.28,104.2 61.28,103.06 61.78,102.55 61.78,91.38 61.4,91 v61.4,90.97 | v54.42,88.33 54.7,88.6 54.7,89.98 U2.28
  Bottom 0.152: v17.21,104.2 17.97,104.2 18.22,103.95 61.02,103.95 v61.28,104.2 | v61.4,90.97 61.38,91 59.88,91 57.59,88.71 54.8,88.71 v54.42,88.33
TXN1  (via drill 0.35)
  Top 0.152: JC1.3 25.84,84.5 25.84,86.59 25.94,86.68 F0:R7.1 25.97,86.69 v25.97,89.73 | U1.42 33.34,89.98 v33.08,89.98
  Bottom 0.152: v33.08,89.98 26.23,89.98 v25.97,89.73
TXN2  (via drill 0.35)
  Top 0.152: JC2.3 25.84,99.52 25.84,97.44 F1:R7.1 26.35,96.93 26.35,91.12 25.34,90.11 25.34,87.29 24.95,86.91 v24.95,81.52 | U1.1 41.47,86.83 41.47,82.26 41.74,81.98 v41.74,81.6
  Bottom 0.152: v41.74,81.6 41.41,81.27 40.65,81.27 40.58,81.34 28.64,81.34 28.23,80.94 25.54,80.94 v24.95,81.52
TXP0  (via drill 0.35)
  Top 0.152: v17.72,103.57 17.34,103.19 17.34,99.12 19.22,97.24 F2:R6.1 19.2,95.82 v18.22,95.82 | U2.29 55.05,89.62 55.05,88.15 v55.18,88.02 | v62.17,90.64 62.17,103.06 v61.91,103.31
  Bottom 0.152: v17.72,103.57 61.66,103.57 v61.91,103.31 | JC0.2 v18.22,95.82 | v55.18,88.02 57.67,88.02 60.26,90.61 60.9,90.61 61.15,90.36 61.89,90.36 v62.17,90.64
TXP1  (via drill 0.35)
  Top 0.152: JC1.2 28.64,84.54 28.64,87.69 28.53,87.8 F0:R6.1 28.51,87.84 28.51,88.58 v29.15,89.22 | U1.43 33.62,89.22 v33.46,89.22
  Bottom 0.152: v33.46,89.22 v29.15,89.22
TXP2  (via drill 0.35)
  Top 0.152: JC2.2 28.64,99.48 28.64,96.21 F1:R6.1 28.51,95.69 28.13,95.31 27.11,95.31 26.73,94.93 26.73,90.61 27.88,89.47 27.88,87.31 27.9,87.29 27.9,86.07 27.5,85.66 27.5,84.14 27.88,83.76 27.88,81.57 v27.93,81.52 | U1.56 40.5,86.75 41.08,86.17 41.08,81.98 v40.96,81.85
  Bottom 0.152: v40.96,81.85 40.83,81.72 28.13,81.72 v27.93,81.52
UART5_RXD  (via drill 0.35)
  Top 0.152: X8.9 109.66,81.63 109.66,80.07 110.43,79.31 110.43,72.2 v110.81,71.82 | v127.95,71.82 128.21,72.07 128.21,73.98 v128.46,74.23 | OK1.6 v138.24,74.48 137.99,74.74 R24.2
  Bottom 0.152: v110.81,71.82 111.06,71.56 127.7,71.56 v127.95,71.82 | v128.46,74.23 128.71,74.48 v138.24,74.48
UART5_TXD  (via drill 0.35)
  Top 0.152: X8.10 109.55,77.42 109.54,77.41 109.54,71.69 v109.79,71.44 | R25.2 129.35,74.87 129.09,74.61 129.09,71.69 v128.84,71.44
  Bottom 0.152: v109.79,71.44 110.05,71.18 128.59,71.18 v128.84,71.44
VDD18CORE  (via drill 0.35)
  Top 0.203: L3.1 38.51,101.88 C15.1 C16.1 38.92,97.81 | 38.92,97.81 38.92,97.34 39.8,96.47 U1.31 | 38.92,97.81 38.92,97.98 39.43,98.49 v39.81,98.49 | v48.32,98.23 48.58,97.98 v48.58,89.22 48.58,86.38 C17.1 | v46.04,89.09 45.78,89.34 45.66,89.34 45.27,89.73 45.15,89.73 44.79,90.09 U1.10
  Bottom 0.203: v39.81,98.49 40.07,98.23 v48.32,98.23 | v46.04,89.09 46.29,88.84 48.2,88.84 v48.58,89.22
VDD18PLL  (via drill 0.35)
  Top 0.152: L3.2 34.74,97.02 34.86,96.9 | U1.41 36.25,92.91 v35.62,93.54 | v34.86,95.95 34.86,96.9 | 34.86,96.9 34.98,96.9 C13.1
  Bottom 0.152: v35.62,93.54 34.86,94.3 v34.86,95.95
VDD18TX
  Top 0.203: U1.51 37.73,87.66 37.73,86.22 38.54,85.41 C20.1 C19.1 | C19.1 C18.1 | U1.48 36.46,88.54 36.46,84.82 37.15,84.14 C19.1
VDD33A1  (via drill 0.35)
  Top 0.203: v33.72,83.12 33.72,86.04 | 33.72,86.04 33.72,87.31 | F0:R9.2 22.16,87.79 F0:R8.2 22.16,87.79 v22.16,83.38 | v26.99,83.25 26.99,86.04 27.11,86.17 27.11,86.3 27.24,86.42 27.24,86.67 F0:R7.2 27.23,86.71 F0:R6.2 | C10.1 33.57,85.9 33.72,86.04
  Top 0.305: JC1.1 30.92,84.39 v29.91,83.38
  Top 0.406: L1.2 12.42,85.28 C9.1 13.31,84.39 v14.41,84.39
  Bottom 0.203: v22.16,83.38 21.65,82.87 | v26.99,83.25 26.61,82.87
  Bottom 0.305: v29.91,83.38 29.4,82.87 29.27,82.87
  Bottom 0.406: v14.41,84.39 15.94,82.87 21.65,82.87 26.61,82.87 29.27,82.87 33.46,82.87 v33.72,83.12
  pour Top: 36.38,91.63 37.78,90.23 36.38,88.84 36.38,85.79 32.19,85.79 32.19,87.44
VDD33A2  (via drill 0.35)
  Top 0.203: C12.1 39.79,84 | F1:R6.2 27.24,96.11 F1:R7.2 27.24,101.54 v26.86,101.92 | F1:R8.2 22.16,96.11 F1:R9.2 22.16,101.41 v21.65,101.92 | v40.32,85.79 40.3,85.79 39.79,85.28 | JC2.1 31.03,96.44 30.29,95.69 v30.29,87.19 | U1.55 39.79,86.91 39.79,86.53
  Top 0.406: v14.54,102.42 13.42,102.42 13.42,102.45 C11.1 12.55,103.31 L2.2 | v30.8,101.92 31.05,101.66 31.05,99.65 JC2.1
  Bottom 0.203: v30.29,87.19 30.9,86.58 36.28,86.58 36.89,87.19 v38.34,87.19
  Bottom 0.406: v30.8,101.92 v26.86,101.92 v21.65,101.92 15.05,101.92 v14.54,102.42
  pour Top: 39.31,88.84 38.04,87.57 38.04,84.9 39.18,84.9 39.18,83.12 40.7,83.12 40.7,87.44
  pour Bottom: 39.18,88.71 37.66,87.19 40.07,84.77 41.59,86.3
VDD33BIAS  (via drill 0.35)
  Top 0.203: v37.91,84.9 37.91,85.41 37.27,86.04 37.27,87.92 U1.50
  Top 0.406: L4.2 12.42,81.6 C14.1 13.36,82.36 v14.41,82.36
  Bottom 0.406: v14.41,82.36 14.54,82.23 37.21,82.23 37.53,82.55 37.53,84.52 v37.91,84.9
VDD_3V3  (via drill 0.35)
  Top 0.406: X8.24 95.82,77.17 95.82,72.2 v96.08,71.95
  Bottom 0.406: v96.08,71.95 108.14,71.95 109.28,73.09 v134.81,73.09
  pour Top (no thermals): 132.14,71.82 136.33,71.82 136.33,75.63 133.29,75.63 132.14,74.48
VDDIO
  Top 0.152: U2.12 60.39,94.95 C30.1
XI
  Top 0.152: O1.3 33.16,94.42 33.21,94.42 33.46,94.17 36.4,94.17 U1.39
XTAL1/CLKIN
  Top 0.152: U2.5 59.37,90.08 59.37,88.91 O2.3

## Text on the board
tNames: ETH0-1
Measures: ESW2 | DRV EN | ESW0 | ESW1 | ESW3 | DMX0-IN | DMX0-OUT | ETH0-0